# EAGLE schematic ReceiverBoardSchematic (EAGLE 9.4.2)
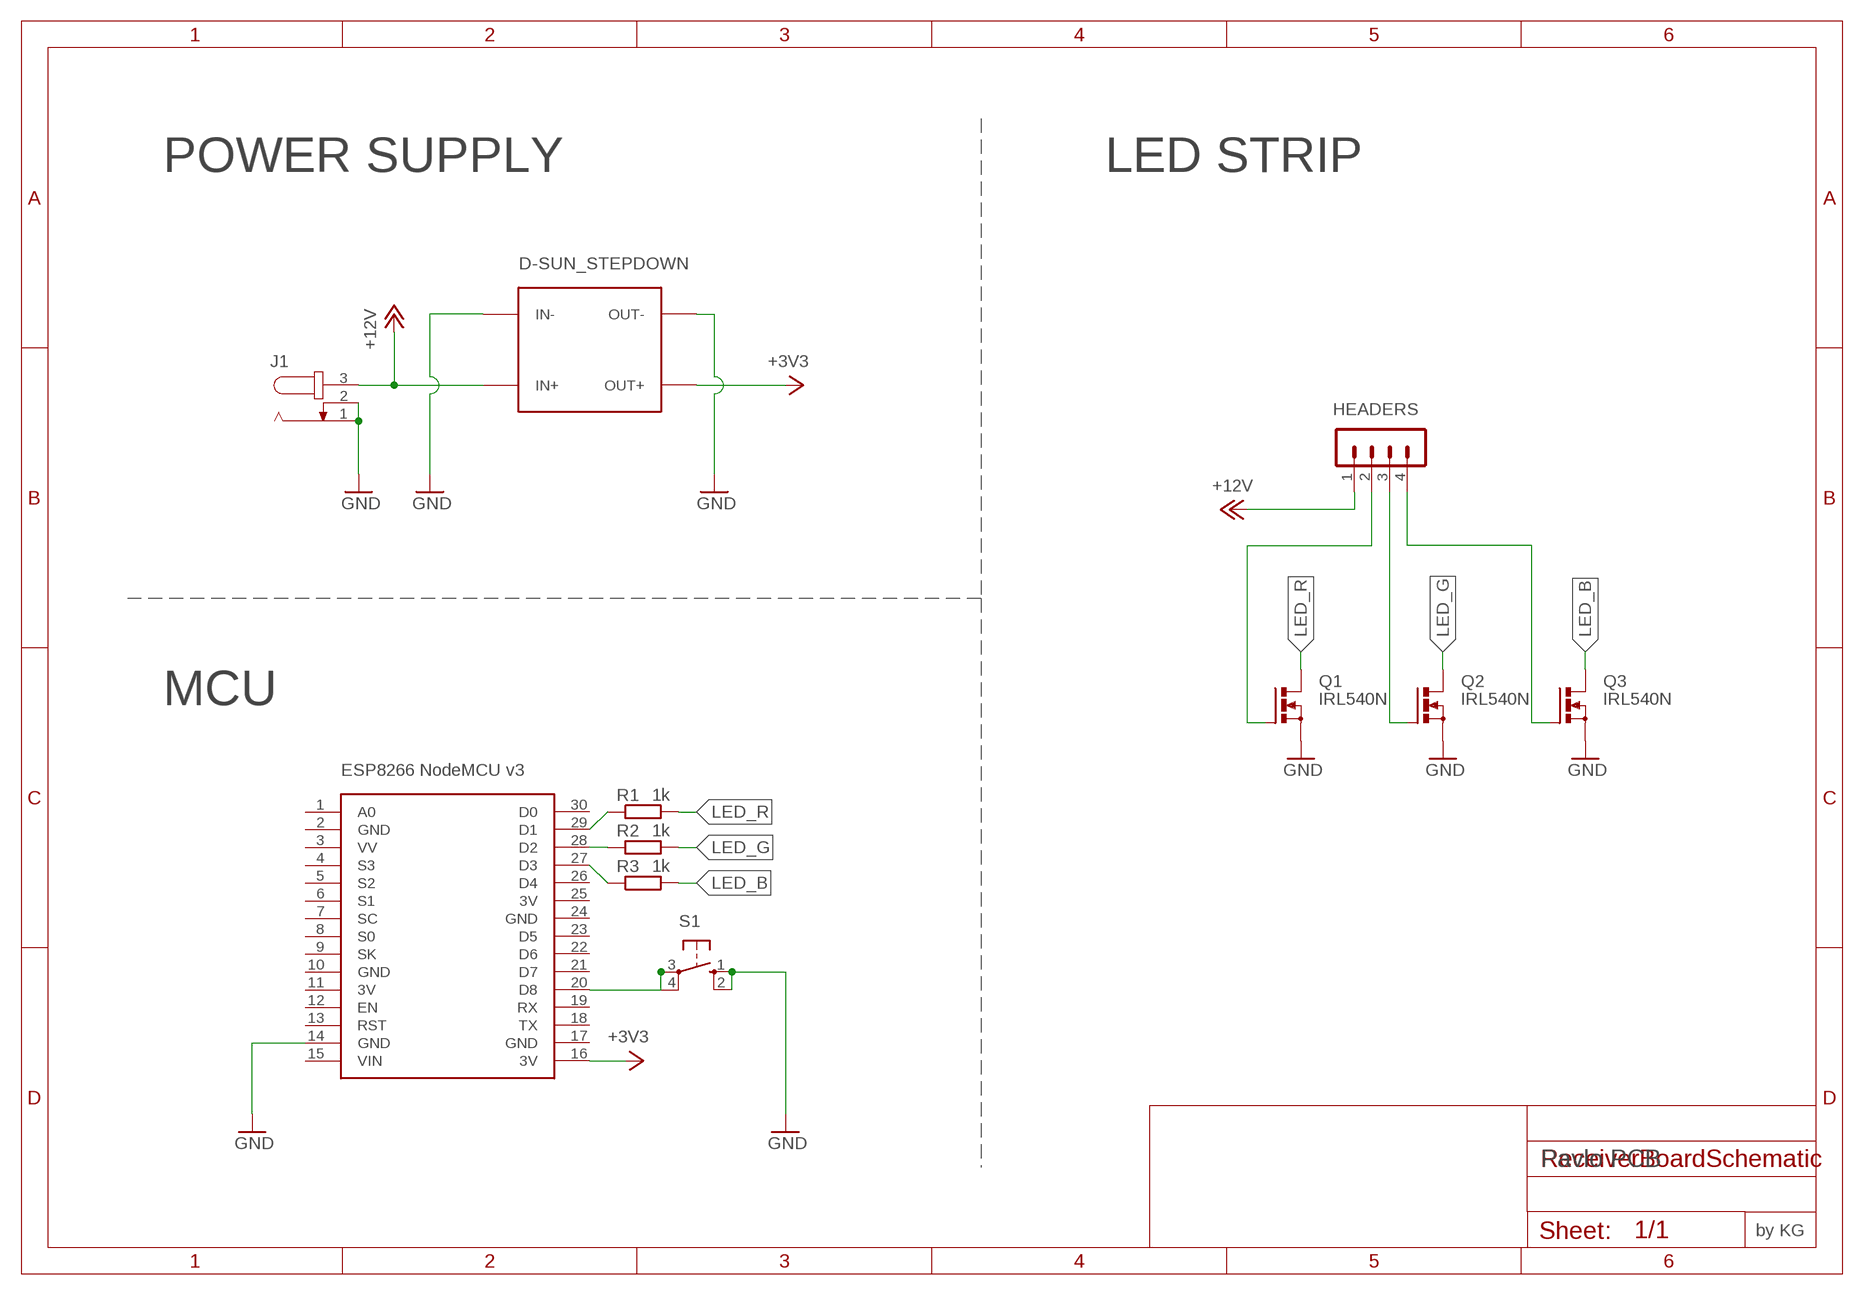
[diagram p0: schematic, sheet 1]

## Parts
D-SUN_STEPDOWN  DC-DC-STEP-DOWN-MP2307  [DC-DC-STEP-DOWN-MP2307]
ESP2866  NODEMCU  [NODEMCU]
HEADERS  MA04-1  [MA04-1]
J1  JACK-PLUG1  [SPC4078]
Q1  IRL540N  IRF512  [TO220BV]
Q2  IRL540N  IRF512  [TO220BV]
Q3  IRL540N  IRF512  [TO220BV]
R1  1k  R-EU_0309/12  [0309/12]
R2  1k  R-EU_0309/12  [0309/12]
R3  1k  R-EU_0309/12  [0309/12]
S1  10-XX  [B3F-10XX]

## Nets
+3V3: D-SUN_STEPDOWN.OUT+ ESP2866.16(3V)
+12V: D-SUN_STEPDOWN.IN+ HEADERS.1 J1.3
GND: D-SUN_STEPDOWN.IN- D-SUN_STEPDOWN.OUT- ESP2866.14(GND) J1.1 J1.2 Q1.S Q2.S Q3.S S1.1(S) S1.2(S1)
LED_B: Q3.D R3.2
LED_G: Q2.D R2.2
LED_R: Q1.D R1.2
N$1: HEADERS.2 Q1.G
N$2: HEADERS.3 Q2.G
N$3: HEADERS.4 Q3.G
N$4: ESP2866.29(D1) R1.1
N$5: ESP2866.28(D2) R2.1
N$6: ESP2866.27(D3) R3.1
S1: ESP2866.20(D8) S1.3(P) S1.4(P1)
Unconnected: ESP2866.1(A0) ESP2866.3(VV) ESP2866.4(S3) ESP2866.5(S2) ESP2866.6(S1) ESP2866.7(SC) ESP2866.8(S0) ESP2866.9(SK) ESP2866.12(EN) ESP2866.13(RST) ESP2866.15(VIN) ESP2866.18(TX) ESP2866.19(RX) ESP2866.21(D7) ESP2866.22(D6) ESP2866.23(D5) ESP2866.26(D4) ESP2866.30(D0)

## Notes on the sheet
- POWER SUPPLY | LED STRIP
- MCU
- ESP8266 NodeMCU v3
- Pavlo PCB
- by KG

## Power pins joined to a net without a drawn wire
3V: ESP2866.11(3V) ESP2866.25(3V)
GND: ESP2866.2(GND) ESP2866.10(GND) ESP2866.17(GND) ESP2866.24(GND)

## Library data of the parts
D-SUN_STEPDOWN = diy-modules:DC-DC-STEP-DOWN-MP2307: DC/DC Step-Down Regulator based on MP2307DN chip MP2307 datasheet available here: https://cdn-shop.adafruit.com/datasheets/MP2307_r1.9.pdf Click here to find device on ebay.com <http://www.ebay.com/sch/dc+dc+3a+mini+converter>
ESP2866 = nodemcu:NODEMCU
HEADERS = con-lstb:MA04-1: PIN HEADER; OC_FARNELL: unknown; OC_NEWARK: unknown
J1 = con-jack:JACK-PLUG: DC POWER JACK Power Jack, DC, Right Angle, Through Hole, Rated 5A at 16VDC, PC Terminals Distributor: Farnell (www.Farnell.de) Drawing: 84N1161.pdf / 84N1162.pdf Manufacturer: SPC Technology (www.spctechnology.com) Type: SPC4077 / SPC 4078; OC_FARNELL: unknown; OC_NEWARK: unknown
Q1-Q3 = transistor-power:IRF512: N-CHANNEL MOS FET
R1-R3 = rcl:R-EU_: RESISTOR, European symbol; SPICEPREFIX: R
S1 = switch-omron:10-XX: OMRON SWITCH; MPN: B3F-1000; OC_FARNELL: 176432; OC_NEWARK: 36M3542